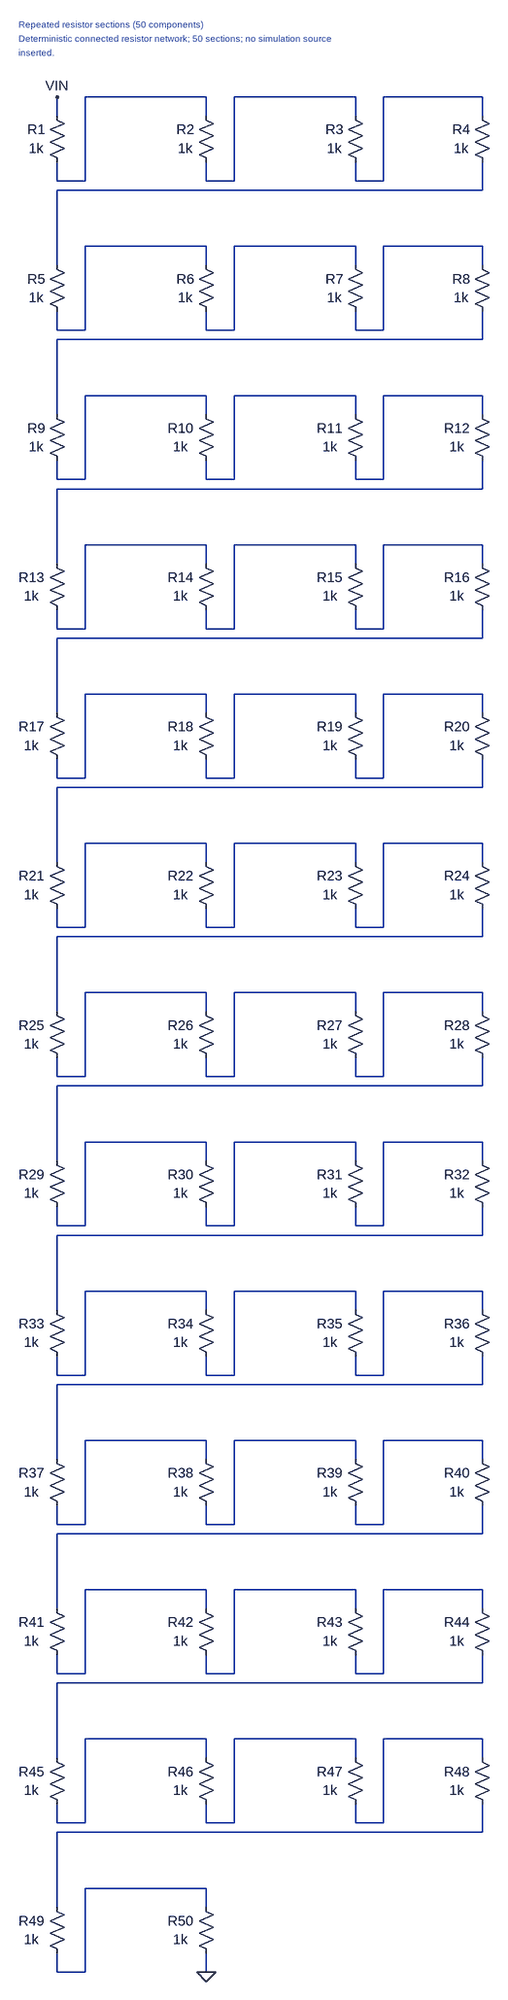
[diagram p0: schematic circuit.asc]
circuit.asc, the LTspice schematic file:
Version 4
SHEET 1 928 3440
SYMBOL res 64 128 R0
WINDOW 0 -20 40 Center 2
WINDOW 3 -20 72 Center 2
SYMATTR InstName R1
SYMATTR Value 1k
SYMBOL res 320 128 R0
WINDOW 0 -20 40 Center 2
WINDOW 3 -20 72 Center 2
SYMATTR InstName R2
SYMATTR Value 1k
SYMBOL res 576 128 R0
WINDOW 0 -20 40 Center 2
WINDOW 3 -20 72 Center 2
SYMATTR InstName R3
SYMATTR Value 1k
SYMBOL res 832 128 R0
WINDOW 0 -20 40 Center 2
WINDOW 3 -20 72 Center 2
SYMATTR InstName R4
SYMATTR Value 1k
SYMBOL res 64 384 R0
WINDOW 0 -20 40 Center 2
WINDOW 3 -20 72 Center 2
SYMATTR InstName R5
SYMATTR Value 1k
SYMBOL res 320 384 R0
WINDOW 0 -20 40 Center 2
WINDOW 3 -20 72 Center 2
SYMATTR InstName R6
SYMATTR Value 1k
SYMBOL res 576 384 R0
WINDOW 0 -20 40 Center 2
WINDOW 3 -20 72 Center 2
SYMATTR InstName R7
SYMATTR Value 1k
SYMBOL res 832 384 R0
WINDOW 0 -20 40 Center 2
WINDOW 3 -20 72 Center 2
SYMATTR InstName R8
SYMATTR Value 1k
SYMBOL res 64 640 R0
WINDOW 0 -20 40 Center 2
WINDOW 3 -20 72 Center 2
SYMATTR InstName R9
SYMATTR Value 1k
SYMBOL res 320 640 R0
WINDOW 0 -28 40 Center 2
WINDOW 3 -28 72 Center 2
SYMATTR InstName R10
SYMATTR Value 1k
SYMBOL res 576 640 R0
WINDOW 0 -28 40 Center 2
WINDOW 3 -28 72 Center 2
SYMATTR InstName R11
SYMATTR Value 1k
SYMBOL res 832 640 R0
WINDOW 0 -28 40 Center 2
WINDOW 3 -28 72 Center 2
SYMATTR InstName R12
SYMATTR Value 1k
SYMBOL res 64 896 R0
WINDOW 0 -28 40 Center 2
WINDOW 3 -28 72 Center 2
SYMATTR InstName R13
SYMATTR Value 1k
SYMBOL res 320 896 R0
WINDOW 0 -28 40 Center 2
WINDOW 3 -28 72 Center 2
SYMATTR InstName R14
SYMATTR Value 1k
SYMBOL res 576 896 R0
WINDOW 0 -28 40 Center 2
WINDOW 3 -28 72 Center 2
SYMATTR InstName R15
SYMATTR Value 1k
SYMBOL res 832 896 R0
WINDOW 0 -28 40 Center 2
WINDOW 3 -28 72 Center 2
SYMATTR InstName R16
SYMATTR Value 1k
SYMBOL res 64 1152 R0
WINDOW 0 -28 40 Center 2
WINDOW 3 -28 72 Center 2
SYMATTR InstName R17
SYMATTR Value 1k
SYMBOL res 320 1152 R0
WINDOW 0 -28 40 Center 2
WINDOW 3 -28 72 Center 2
SYMATTR InstName R18
SYMATTR Value 1k
SYMBOL res 576 1152 R0
WINDOW 0 -28 40 Center 2
WINDOW 3 -28 72 Center 2
SYMATTR InstName R19
SYMATTR Value 1k
SYMBOL res 832 1152 R0
WINDOW 0 -28 40 Center 2
WINDOW 3 -28 72 Center 2
SYMATTR InstName R20
SYMATTR Value 1k
SYMBOL res 64 1408 R0
WINDOW 0 -28 40 Center 2
WINDOW 3 -28 72 Center 2
SYMATTR InstName R21
SYMATTR Value 1k
SYMBOL res 320 1408 R0
WINDOW 0 -28 40 Center 2
WINDOW 3 -28 72 Center 2
SYMATTR InstName R22
SYMATTR Value 1k
SYMBOL res 576 1408 R0
WINDOW 0 -28 40 Center 2
WINDOW 3 -28 72 Center 2
SYMATTR InstName R23
SYMATTR Value 1k
SYMBOL res 832 1408 R0
WINDOW 0 -28 40 Center 2
WINDOW 3 -28 72 Center 2
SYMATTR InstName R24
SYMATTR Value 1k
SYMBOL res 64 1664 R0
WINDOW 0 -28 40 Center 2
WINDOW 3 -28 72 Center 2
SYMATTR InstName R25
SYMATTR Value 1k
SYMBOL res 320 1664 R0
WINDOW 0 -28 40 Center 2
WINDOW 3 -28 72 Center 2
SYMATTR InstName R26
SYMATTR Value 1k
SYMBOL res 576 1664 R0
WINDOW 0 -28 40 Center 2
WINDOW 3 -28 72 Center 2
SYMATTR InstName R27
SYMATTR Value 1k
SYMBOL res 832 1664 R0
WINDOW 0 -28 40 Center 2
WINDOW 3 -28 72 Center 2
SYMATTR InstName R28
SYMATTR Value 1k
SYMBOL res 64 1920 R0
WINDOW 0 -28 40 Center 2
WINDOW 3 -28 72 Center 2
SYMATTR InstName R29
SYMATTR Value 1k
SYMBOL res 320 1920 R0
WINDOW 0 -28 40 Center 2
WINDOW 3 -28 72 Center 2
SYMATTR InstName R30
SYMATTR Value 1k
SYMBOL res 576 1920 R0
WINDOW 0 -28 40 Center 2
WINDOW 3 -28 72 Center 2
SYMATTR InstName R31
SYMATTR Value 1k
SYMBOL res 832 1920 R0
WINDOW 0 -28 40 Center 2
WINDOW 3 -28 72 Center 2
SYMATTR InstName R32
SYMATTR Value 1k
SYMBOL res 64 2176 R0
WINDOW 0 -28 40 Center 2
WINDOW 3 -28 72 Center 2
SYMATTR InstName R33
SYMATTR Value 1k
SYMBOL res 320 2176 R0
WINDOW 0 -28 40 Center 2
WINDOW 3 -28 72 Center 2
SYMATTR InstName R34
SYMATTR Value 1k
SYMBOL res 576 2176 R0
WINDOW 0 -28 40 Center 2
WINDOW 3 -28 72 Center 2
SYMATTR InstName R35
SYMATTR Value 1k
SYMBOL res 832 2176 R0
WINDOW 0 -28 40 Center 2
WINDOW 3 -28 72 Center 2
SYMATTR InstName R36
SYMATTR Value 1k
SYMBOL res 64 2432 R0
WINDOW 0 -28 40 Center 2
WINDOW 3 -28 72 Center 2
SYMATTR InstName R37
SYMATTR Value 1k
SYMBOL res 320 2432 R0
WINDOW 0 -28 40 Center 2
WINDOW 3 -28 72 Center 2
SYMATTR InstName R38
SYMATTR Value 1k
SYMBOL res 576 2432 R0
WINDOW 0 -28 40 Center 2
WINDOW 3 -28 72 Center 2
SYMATTR InstName R39
SYMATTR Value 1k
SYMBOL res 832 2432 R0
WINDOW 0 -28 40 Center 2
WINDOW 3 -28 72 Center 2
SYMATTR InstName R40
SYMATTR Value 1k
SYMBOL res 64 2688 R0
WINDOW 0 -28 40 Center 2
WINDOW 3 -28 72 Center 2
SYMATTR InstName R41
SYMATTR Value 1k
SYMBOL res 320 2688 R0
WINDOW 0 -28 40 Center 2
WINDOW 3 -28 72 Center 2
SYMATTR InstName R42
SYMATTR Value 1k
SYMBOL res 576 2688 R0
WINDOW 0 -28 40 Center 2
WINDOW 3 -28 72 Center 2
SYMATTR InstName R43
SYMATTR Value 1k
SYMBOL res 832 2688 R0
WINDOW 0 -28 40 Center 2
WINDOW 3 -28 72 Center 2
SYMATTR InstName R44
SYMATTR Value 1k
SYMBOL res 64 2944 R0
WINDOW 0 -28 40 Center 2
WINDOW 3 -28 72 Center 2
SYMATTR InstName R45
SYMATTR Value 1k
SYMBOL res 320 2944 R0
WINDOW 0 -28 40 Center 2
WINDOW 3 -28 72 Center 2
SYMATTR InstName R46
SYMATTR Value 1k
SYMBOL res 576 2944 R0
WINDOW 0 -28 40 Center 2
WINDOW 3 -28 72 Center 2
SYMATTR InstName R47
SYMATTR Value 1k
SYMBOL res 832 2944 R0
WINDOW 0 -28 40 Center 2
WINDOW 3 -28 72 Center 2
SYMATTR InstName R48
SYMATTR Value 1k
SYMBOL res 64 3200 R0
WINDOW 0 -28 40 Center 2
WINDOW 3 -28 72 Center 2
SYMATTR InstName R49
SYMATTR Value 1k
SYMBOL res 320 3200 R0
WINDOW 0 -28 40 Center 2
WINDOW 3 -28 72 Center 2
SYMATTR InstName R50
SYMATTR Value 1k
WIRE 80 112 80 144
WIRE 80 224 80 256
WIRE 80 256 128 256
WIRE 80 272 80 400
WIRE 80 272 848 272
WIRE 80 480 80 512
WIRE 80 512 128 512
WIRE 80 528 80 656
WIRE 80 528 848 528
WIRE 80 736 80 768
WIRE 80 768 128 768
WIRE 80 784 80 912
WIRE 80 784 848 784
WIRE 80 992 80 1024
WIRE 80 1024 128 1024
WIRE 80 1040 80 1168
WIRE 80 1040 848 1040
WIRE 80 1248 80 1280
WIRE 80 1280 128 1280
WIRE 80 1296 80 1424
WIRE 80 1296 848 1296
WIRE 80 1504 80 1536
WIRE 80 1536 128 1536
WIRE 80 1552 80 1680
WIRE 80 1552 848 1552
WIRE 80 1760 80 1792
WIRE 80 1792 128 1792
WIRE 80 1808 80 1936
WIRE 80 1808 848 1808
WIRE 80 2016 80 2048
WIRE 80 2048 128 2048
WIRE 80 2064 80 2192
WIRE 80 2064 848 2064
WIRE 80 2272 80 2304
WIRE 80 2304 128 2304
WIRE 80 2320 80 2448
WIRE 80 2320 848 2320
WIRE 80 2528 80 2560
WIRE 80 2560 128 2560
WIRE 80 2576 80 2704
WIRE 80 2576 848 2576
WIRE 80 2784 80 2816
WIRE 80 2816 128 2816
WIRE 80 2832 80 2960
WIRE 80 2832 848 2832
WIRE 80 3040 80 3072
WIRE 80 3072 128 3072
WIRE 80 3088 80 3216
WIRE 80 3088 848 3088
WIRE 80 3296 80 3328
WIRE 80 3328 128 3328
WIRE 128 112 128 256
WIRE 128 112 336 112
WIRE 128 368 128 512
WIRE 128 368 336 368
WIRE 128 624 128 768
WIRE 128 624 336 624
WIRE 128 880 128 1024
WIRE 128 880 336 880
WIRE 128 1136 128 1280
WIRE 128 1136 336 1136
WIRE 128 1392 128 1536
WIRE 128 1392 336 1392
WIRE 128 1648 128 1792
WIRE 128 1648 336 1648
WIRE 128 1904 128 2048
WIRE 128 1904 336 1904
WIRE 128 2160 128 2304
WIRE 128 2160 336 2160
WIRE 128 2416 128 2560
WIRE 128 2416 336 2416
WIRE 128 2672 128 2816
WIRE 128 2672 336 2672
WIRE 128 2928 128 3072
WIRE 128 2928 336 2928
WIRE 128 3184 128 3328
WIRE 128 3184 336 3184
WIRE 336 112 336 144
WIRE 336 224 336 256
WIRE 336 256 384 256
WIRE 336 368 336 400
WIRE 336 480 336 512
WIRE 336 512 384 512
WIRE 336 624 336 656
WIRE 336 736 336 768
WIRE 336 768 384 768
WIRE 336 880 336 912
WIRE 336 992 336 1024
WIRE 336 1024 384 1024
WIRE 336 1136 336 1168
WIRE 336 1248 336 1280
WIRE 336 1280 384 1280
WIRE 336 1392 336 1424
WIRE 336 1504 336 1536
WIRE 336 1536 384 1536
WIRE 336 1648 336 1680
WIRE 336 1760 336 1792
WIRE 336 1792 384 1792
WIRE 336 1904 336 1936
WIRE 336 2016 336 2048
WIRE 336 2048 384 2048
WIRE 336 2160 336 2192
WIRE 336 2272 336 2304
WIRE 336 2304 384 2304
WIRE 336 2416 336 2448
WIRE 336 2528 336 2560
WIRE 336 2560 384 2560
WIRE 336 2672 336 2704
WIRE 336 2784 336 2816
WIRE 336 2816 384 2816
WIRE 336 2928 336 2960
WIRE 336 3040 336 3072
WIRE 336 3072 384 3072
WIRE 336 3184 336 3216
WIRE 336 3296 336 3328
WIRE 384 112 384 256
WIRE 384 112 592 112
WIRE 384 368 384 512
WIRE 384 368 592 368
WIRE 384 624 384 768
WIRE 384 624 592 624
WIRE 384 880 384 1024
WIRE 384 880 592 880
WIRE 384 1136 384 1280
WIRE 384 1136 592 1136
WIRE 384 1392 384 1536
WIRE 384 1392 592 1392
WIRE 384 1648 384 1792
WIRE 384 1648 592 1648
WIRE 384 1904 384 2048
WIRE 384 1904 592 1904
WIRE 384 2160 384 2304
WIRE 384 2160 592 2160
WIRE 384 2416 384 2560
WIRE 384 2416 592 2416
WIRE 384 2672 384 2816
WIRE 384 2672 592 2672
WIRE 384 2928 384 3072
WIRE 384 2928 592 2928
WIRE 592 112 592 144
WIRE 592 224 592 256
WIRE 592 256 640 256
WIRE 592 368 592 400
WIRE 592 480 592 512
WIRE 592 512 640 512
WIRE 592 624 592 656
WIRE 592 736 592 768
WIRE 592 768 640 768
WIRE 592 880 592 912
WIRE 592 992 592 1024
WIRE 592 1024 640 1024
WIRE 592 1136 592 1168
WIRE 592 1248 592 1280
WIRE 592 1280 640 1280
WIRE 592 1392 592 1424
WIRE 592 1504 592 1536
WIRE 592 1536 640 1536
WIRE 592 1648 592 1680
WIRE 592 1760 592 1792
WIRE 592 1792 640 1792
WIRE 592 1904 592 1936
WIRE 592 2016 592 2048
WIRE 592 2048 640 2048
WIRE 592 2160 592 2192
WIRE 592 2272 592 2304
WIRE 592 2304 640 2304
WIRE 592 2416 592 2448
WIRE 592 2528 592 2560
WIRE 592 2560 640 2560
WIRE 592 2672 592 2704
WIRE 592 2784 592 2816
WIRE 592 2816 640 2816
WIRE 592 2928 592 2960
WIRE 592 3040 592 3072
WIRE 592 3072 640 3072
WIRE 640 112 640 256
WIRE 640 112 848 112
WIRE 640 368 640 512
WIRE 640 368 848 368
WIRE 640 624 640 768
WIRE 640 624 848 624
WIRE 640 880 640 1024
WIRE 640 880 848 880
WIRE 640 1136 640 1280
WIRE 640 1136 848 1136
WIRE 640 1392 640 1536
WIRE 640 1392 848 1392
WIRE 640 1648 640 1792
WIRE 640 1648 848 1648
WIRE 640 1904 640 2048
WIRE 640 1904 848 1904
WIRE 640 2160 640 2304
WIRE 640 2160 848 2160
WIRE 640 2416 640 2560
WIRE 640 2416 848 2416
WIRE 640 2672 640 2816
WIRE 640 2672 848 2672
WIRE 640 2928 640 3072
WIRE 640 2928 848 2928
WIRE 848 112 848 144
WIRE 848 224 848 272
WIRE 848 368 848 400
WIRE 848 480 848 528
WIRE 848 624 848 656
WIRE 848 736 848 784
WIRE 848 880 848 912
WIRE 848 992 848 1040
WIRE 848 1136 848 1168
WIRE 848 1248 848 1296
WIRE 848 1392 848 1424
WIRE 848 1504 848 1552
WIRE 848 1648 848 1680
WIRE 848 1760 848 1808
WIRE 848 1904 848 1936
WIRE 848 2016 848 2064
WIRE 848 2160 848 2192
WIRE 848 2272 848 2320
WIRE 848 2416 848 2448
WIRE 848 2528 848 2576
WIRE 848 2672 848 2704
WIRE 848 2784 848 2832
WIRE 848 2928 848 2960
WIRE 848 3040 848 3088
FLAG 336 3328 0
FLAG 80 112 VIN
TEXT 14 -12 Left 1 ;Repeated resistor sections (50 components)
TEXT 14 12 Left 1 ;Deterministic connected resistor network; 50 sections; no simulation source
TEXT 14 36 Left 1 ;inserted.

The netlist it stands for:
* circuit.asc
R1 VIN N001 1k
R2 N001 N026 1k
R3 N026 N038 1k
R4 N038 N002 1k
R5 N002 N003 1k
R6 N003 N027 1k
R7 N027 N039 1k
R8 N039 N004 1k
R9 N004 N005 1k
R10 N005 N028 1k
R11 N028 N040 1k
R12 N040 N006 1k
R13 N006 N007 1k
R14 N007 N029 1k
R15 N029 N041 1k
R16 N041 N008 1k
R17 N008 N009 1k
R18 N009 N030 1k
R19 N030 N042 1k
R20 N042 N010 1k
R21 N010 N011 1k
R22 N011 N031 1k
R23 N031 N043 1k
R24 N043 N012 1k
R25 N012 N013 1k
R26 N013 N032 1k
R27 N032 N044 1k
R28 N044 N014 1k
R29 N014 N015 1k
R30 N015 N033 1k
R31 N033 N045 1k
R32 N045 N016 1k
R33 N016 N017 1k
R34 N017 N034 1k
R35 N034 N046 1k
R36 N046 N018 1k
R37 N018 N019 1k
R38 N019 N035 1k
R39 N035 N047 1k
R40 N047 N020 1k
R41 N020 N021 1k
R42 N021 N036 1k
R43 N036 N048 1k
R44 N048 N022 1k
R45 N022 N023 1k
R46 N023 N037 1k
R47 N037 N049 1k
R48 N049 N024 1k
R49 N024 N025 1k
R50 N025 0 1k
* Repeated resistor sections (50 components)
* Deterministic connected resistor network; 50 sections; no simulation source
* inserted.
.backanno
.end